# Altium schematic sheet SFP Connectors.SchDoc
size 209 x 297 mm; Author: ALTIUM GOSTBOM2.0 KEV; SheetNumber: 30; SheetTotal: 48
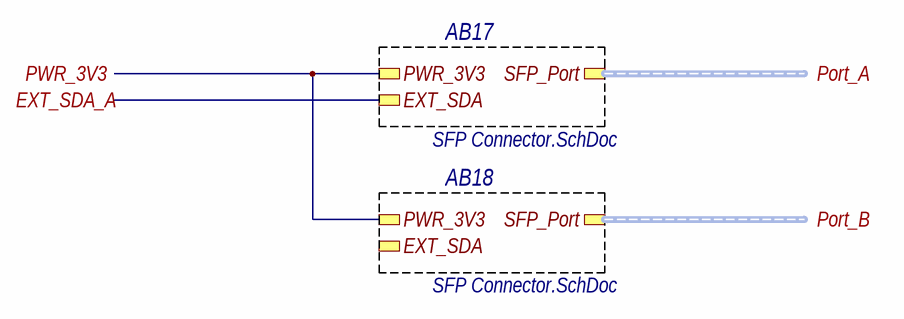
[diagram p0: SFP Connectors.SchDoc]

## Sub-sheets
AB17 = SFP Connector.SchDoc: SFP_Port (harness SFP), PWR_3V3, EXT_SDA
AB18 = SFP Connector.SchDoc: SFP_Port (harness SFP), PWR_3V3, EXT_SDA

## Ports
EXT_SDA_A, Port_A (harness SFP), Port_B (harness SFP), PWR_3V3

## Nets
EXT_SDA_A: port EXT_SDA_A, sheet AB17/EXT_SDA
PWR_3V3: port PWR_3V3, sheet AB17/PWR_3V3, sheet AB18/PWR_3V3

## Buses and harness runs
harness port Port_A = sheet AB17/SFP_Port
harness port Port_B = sheet AB18/SFP_Port

## Notes on the sheet
- Подп. дата
- Инв. № дубл.
- Взам. инв. №
- Подп. и дата
- Инв. № подл.
- Изм.
- Лист
- № докум.
- Подп.
- Дата
- Файл:
- ALTIUM GOSTBOM2.0 KEV
- Копировал
- Формат А4